# Altium project ASURT_Latch_Egypt.PrjPcb
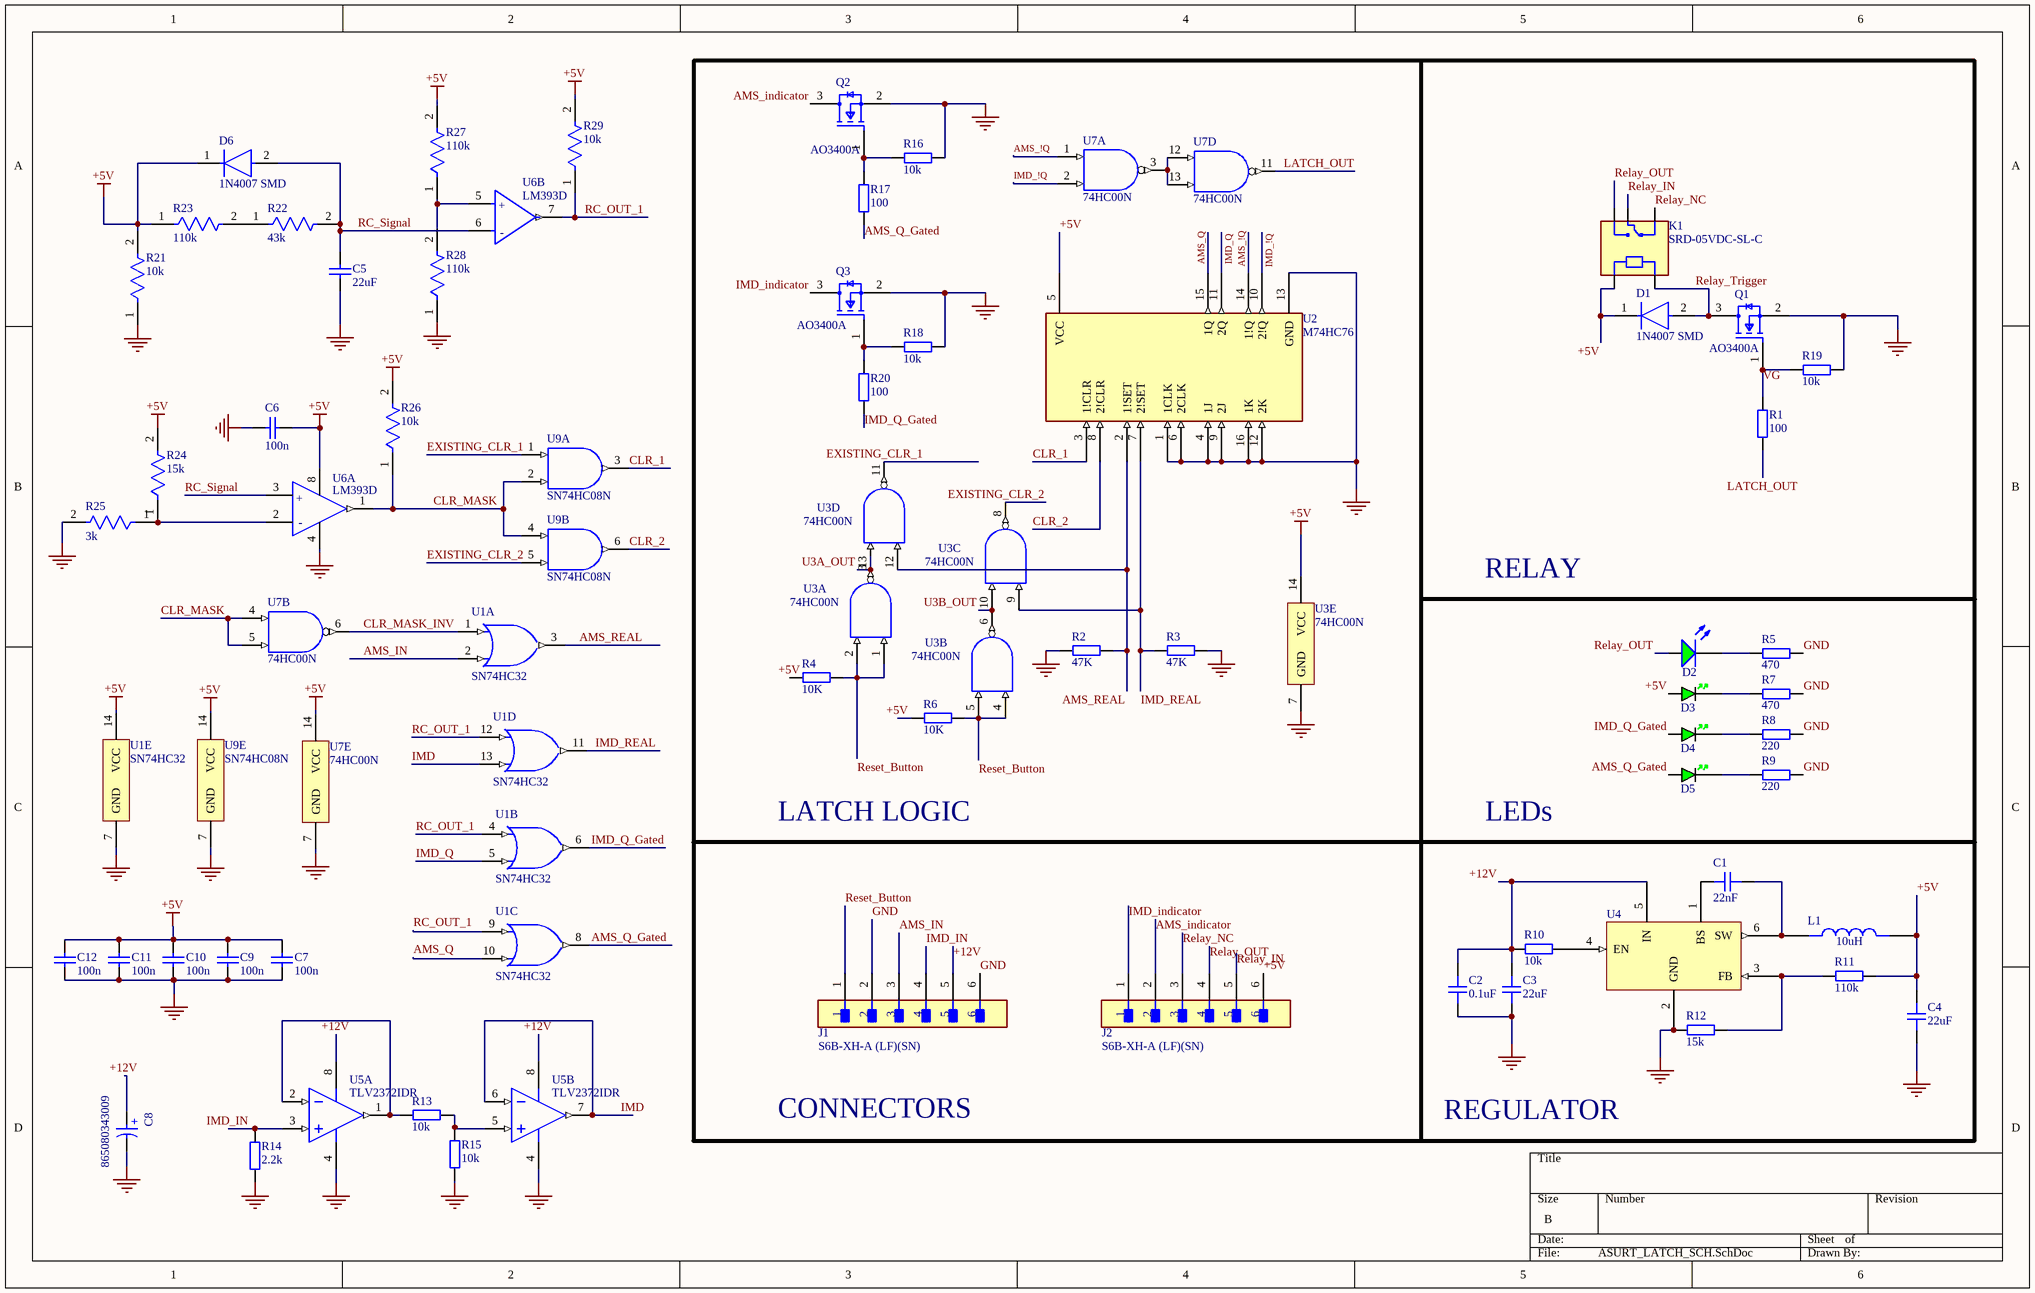
[diagram p0: ASURT_LATCH_SCH.SchDoc]
1 sheet, 62 parts. Net scope: global (net labels, ports and power ports of the same name join across sheets).
Board file: ASURT_LATCH_PCB.PcbDoc

## Sheet ASURT_LATCH_SCH.SchDoc
size B; SheetNumber: 1; SheetTotal: 1

### Parts
C1  22nF  [CAP_0805]
C2  0.1uF  [CAP_0805]
C3  22uF  [CAP_1210]
C4  22uF  [CAP_1210]
C5  22uF  [CAPC2013X145X48ML20T23]
C6  100n  [CAPC2013X145X48ML20T23]
C7  100n  [CAPC2013X145X48ML20T23]
C8  865080343009  [WCAP-ASLI_D6.3H5.5]
C9  100n  [CAPC2013X145X48ML20T23]
C10  100n  [CAPC2013X145X48ML20T23]
C11  100n  [CAPC2013X145X48ML20T23]
C12  100n  [CAPC2013X145X48ML20T23]
D1  1N4007 SMD  [FP-1N4007_SMD-IPC_C]
D2  HLMP-4740  [AVAG-HLMP-4740]  (value not drawn)
D3  GREEN  [LED_0805_GREEN]  (value not drawn)
D4  GREEN  [LED_0805_GREEN]  (value not drawn)
D5  GREEN  [LED_0805_GREEN]  (value not drawn)
D6  1N4007 SMD  [FP-1N4007_SMD-IPC_C]
J1  S6B-XH-A (LF)(SN)  [FP-S6B-XH-A_LF_SN-MFG]
J2  S6B-XH-A (LF)(SN)  [FP-S6B-XH-A_LF_SN-MFG]
K1  SRD-05VDC-SL-C  [RELAY_SRD-05VDC-SL-C]
L1  10uH  [PCBComponent_1 - duplicate1]
Q1  AO3400A  [FP-SOT23-MFG]
Q2  AO3400A  [FP-SOT23-MFG]
Q3  AO3400A  [FP-SOT23-MFG]
R1  100  [RES_0805]
R2  47K  [RES_0805]
R3  47K  [RES_0805]
R4  10K  [RES_0805]
R5  470  [RES_0805]
R6  10K  [RES_0805]
R7  470  [RES_0805]
R8  220  [RES_0805]
R9  220  [RES_0805]
R10  10k  [RES_0805]
R11  110k  [RES_0805]
R12  15k  [RES_0805]
R13  10k  [RES_0805]
R14  2.2k  [RES_0805]
R15  10k  [RES_0805]
R16  10k  [RES_0805]
R17  100  [RES_0805]
R18  10k  [RES_0805]
R19  10k  [RES_0805]
R20  100  [RES_0805]
R21  10k  [FP-RMCF0805-MFG]
R22  43k  [FP-RMCF0805-MFG]
R23  110k  [FP-RMCF0805-MFG]
R24  15k  [FP-RMCF0805-MFG]
R25  3k  [FP-RMCF0805-MFG]
R26  10k  [FP-RMCF0805-MFG]
R27  110k  [FP-RMCF0805-MFG]
R28  110k  [FP-RMCF0805-MFG]
R29  10k  [FP-RMCF0805-MFG]
U1  SN74HC32  [N0014A]  (parts A,B,C,D,E of 5)
U2  M74HC76  [PCBComponent_1]
U3  74HC00N  [NXP-SOT27-1-14]  (parts A,B,C,D,E of 5)
U4  (no value)  [PCBComponent_1 - duplicate]
U5  TLV2372IDR  [D0008A_M]  (parts A,B of 2)
U6  LM393D  [FP-SO8-MFG]  (parts A,B of 2)
U7  74HC00N  [N0014A]  (parts A,B,D,E of 5)
U9  SN74HC08N  [N0014A]  (parts A,B,E of 5)

### Nets
+5V: C4.2 C6.1 C7.2 C9.1 C10.2 C11.1 C12.1 D1.1(C) D3.A D6.1(C) J2.6 K1.A1 L1.2 R4.1 R6.1 R11.1 R21.2 R23.1 R24.2 R26.2 R27.2 R29.2 U1.14(VCC) U2.5(VCC) U3.14(VCC) U6.8(Vcc+) U7.14(VCC) U9.14(VCC)
GND: C2.1 C3.1 C4.1 C5.1 C6.2 C7.1 C8.2(N) C9.2 C10.1 C11.2 C12.2 J1.2 J1.6 Q1.2(S) Q2.2(S) Q3.2(S) R2.1 R3.2 R5.1 R7.1 R8.1 R9.1 R12.2 R14.1 R15.1 R16.1 R18.1 R19.1 R21.1 R25.2 R28.1 U1.7(GND) U2.1(1CLK) U2.4(1J) U2.6(2CLK) U2.9(2J) U2.12(2K) U2.13(GND) U2.16(1K) U3.7(GND) U4.2(GND) U5.4(GND) U6.4(Vcc-) U7.7(GND) U9.7(GND)
+12V: C2.2 C3.2 C8.1(P) J1.5 R10.2 U4.5(IN) U5.8(VDD)
AMS_!Q: U2.14(1!Q) U7.1(1A)
AMS_IN: J1.3 U1.2(1B)
AMS_indicator: J2.2 Q2.3(D)
AMS_Q: U1.10(3B) U2.15(1Q)
AMS_Q_Gated: D5.A R17.1 U1.8(3Y)
AMS_REAL: R2.2 U1.3(1Y) U2.2(1!SET) U3.12(4A)
CLR_1: U2.3(1!CLR) U9.3(1Y)
CLR_2: U2.8(2!CLR) U9.6(2Y)
CLR_MASK: R26.1 U6.1(Out1) U7.4(2A) U7.5(2B) U9.2(1B) U9.4(2A)
CLR_MASK_INV: U1.1(1A) U7.6(2Y)
EXISTING_CLR_1: U3.11(~{4Y}) U9.1(1A)
EXISTING_CLR_2: U3.8(~{3Y}) U9.5(2B)
IMD: U1.13(4B) U5.6(IN2-) U5.7(OUT2)
IMD_!Q: U2.10(2!Q) U7.2(1B)
IMD_IN: J1.4 R14.2 U5.3(IN1+)
IMD_indicator: J2.1 Q3.3(D)
IMD_Q: U1.5(2B) U2.11(2Q)
IMD_Q_Gated: D4.A R20.1 U1.6(2Y)
IMD_REAL: R3.1 U1.11(4Y) U2.7(2!SET) U3.9(3A)
LATCH_OUT: R1.1 U7.11(4Y)
RC_OUT_1: R29.1 U1.4(2A) U1.9(3A) U1.12(4A) U6.7(Out2)
RC_Signal: C5.2 D6.2(A) R22.2 U6.3(In1+) U6.6(In2-)
Relay_IN: J2.5 K1.COM
Relay_NC: J2.3 K1.NC
Relay_OUT: D2.1(A) J2.4 K1.NO
Relay_Trigger: D1.2(A) K1.A2 Q1.3(D)
Reset_Button: J1.1 R4.2 R6.2 U3.1(1A) U3.2(1B) U3.4(2A) U3.5(2B)
U3A_OUT: U3.3(~{1Y}) U3.13(4B)
U3B_OUT: U3.6(~{2Y}) U3.10(3B)
VG: Q1.1(G) R1.2 R19.2
NetC1_1: C1.1 L1.1 U4.6(SW)
NetC1_2: C1.2 U4.1(BS)
NetD2_2: D2.2(K) R5.2
NetD3_K: D3.K R7.2
NetD4_K: D4.K R8.2
NetD5_K: D5.K R9.2
NetQ2_1: Q2.1(G) R16.2 R17.2
NetQ3_1: Q3.1(G) R18.2 R20.2
NetR10_1: R10.1 U4.4(EN)
NetR11_2: R11.2 R12.1 U4.3(FB)
NetR13_1: R13.1 R15.2 U5.5(IN2+)
NetR13_2: R13.2 U5.1(OUT1) U5.2(IN1-)
NetR22_1: R22.1 R23.2
NetR24_1: R24.1 R25.1 U6.2(In1-)
NetR27_1: R27.1 R28.2 U6.5(In2+)
NetU7_3: U7.3(1Y) U7.12(4A) U7.13(4B)

### Notes on the sheet
- RELAY
- LATCH LOGIC
- LEDs
- CONNECTORS
- REGULATOR
- (in symbol CMP-03913-53914574-2) +
- (in symbol CMP-12132-000003-1, part A) +; -
- (in symbol CMP-12132-000003-1, part B) +; -

### Library data of the parts
C1 C2 = CAP_0805: Capacitor SMD 0805; Manufacturer: *; Manufacturer Part Number: *; Distributor Link: *; LCSC: *; Rating: *; Dielectric: *
C3 C4 = CAP_1210: Capacitor SMD 1210; Manufacturer: *; Manufacturer Part Number: *; Distributor Link: *; LCSC: *; Rating: *; Dielectric: *
C5-C7 C9-C12 = CMP-2007-03205-1: Manufacturer: Vitramon; Part Number: VJ0805Y682KXAMT
C8 = CMP-03913-53914574-2: Alum. Electrolytic Cap 100UF 16V 6.3MMV-CHIP Wcap-asli, Lifetime 2000H +105OC; Ripple Current: 255mA; Life (Hours): 2000hours; Leakage Current: 16µA; Tolerance: 20%; Impedance: 520mΩ; Capacitance: 100µF; ESR (Equivalent Series Resistance): 399.422mΩ; Insulation Resistance: 1MΩ; Polarity: Polar; Diameter: 6.3mm; Width: 6.6mm; REACH SVHC: Unknown; Lead Free: Lead Free; Ripple Current (AC): 255mA; Voltage Rating: 16V; Max Operating Temperature: 105°C; Case/Package: Radial; Height: 5.5mm; Mount: Surface Mount; Voltage Rating (DC): 16V; RoHS: Compliant; Min Operating Temperature: -55°C; Height - Seated (Max): 5.5118mm; Length: 5.5mm
D1 D6 = CMP-12389-000001-1: Rectifier, 1Kv, 1A, Do-214Ac Rohs Compliant: Yes
D2 = CMP-2000-06413-1: T-1 3/4 (5 mm) Low Current LED Lamp, Green, 1.9 V, -20 to 100 degC, 2-Pin THD, RoHS, Bulk; Manufacturer: AvagoTechnologies; Type: Uni-Color; Peak Wavelength: 565nm; Rad Hard: No; Viewing Angle: 50°; Dominant Wavelength/Color Temperature: 569nm; Number of LEDs: 1; Lens Appearance: ColoredDiffused; Lens Shape Type: Circular; Mounting Orientation: TopMount; Intensity: 2.3mcd; Datasheet Version: 07/2014; Category: LEDs; Datasheet URL: http://docs.avagotech.com/docs/AV02-1557EN; Packaging: Bulk; Pin Count: 2; Mounting Technology: ThroughHole; Package Reference: HLMP-4740; Mounting: ThroughHole; Manufacturer URL: http://www.avagotech.com/; Color: Green; Package: 2T-13/4; Package Description: 2-Pin Through Hole Device, Dia 5.845 mm, Pitch 2.54 mm
D3-D5 = LED_0805_GREEN: LED 0805 GREEN SMD; Manufacturer: *; Manufacturer Part Number: *; Distributor Link: *; LCSC: *
J1 J2 = CMP-17439-000165-2: CONN HEADER R/A 6POS 2.5MM; Number of Contacts: 6; Contact Resistance: 20mR; Max Current Rating: 3A; Max Voltage Rating (AC): 250V; Gender: Male; Insulation Resistance: 1GR; Wire/Cable Gauge: 22AWG; Fastening Type: Detent; Lead Pitch: 2.5mm; Flammability Rating: UL94 V-0; Contact Finish - Mating: TIN; Housing Material: Polyamide; Length: 17.4mm; Termination: Solder; Contact Type: Male Pin; Number of Positions: 6; Mount: Through Hole; Orientation: Right Angle; Voltage Rating (AC): 250V; Contact Shape: Square; Lead Free: Lead Free; Insulation Material: Nylon; Insulation Color: Natural; Contact Plating: Tin; Connector Type: Header; Housing Color: White; Color: Natural; Package Quantity: 500; Contact Material: Brass; Packaging: Bulk; Pitch: 2.5mm; Series: XH; Number of Rows: 1; Min Operating Temperature: -25°C; Voltage Rating: 250V; REACH SVHC: No SVHC; Current Rating: 3A; Depth: 11.5mm; Max Operating Temperature: 85°C
K1 = SRD-05VDC-SL-C: 5V Trigger Relay Module For Arduino And Raspberry Pi 5V Trigger Relay Module For Arduino And Raspberry Pi; MF: Songle Relay; Check_prices: https://www.snapeda.com/parts/SRD-05VDC-SL-C/Songle+Relay/view-part/?ref=eda; Value: *; Availability: Not in stock; Price: None; Package: NON STANDARD-5 Songle Relay; MP: SRD-05VDC-SL-C; SnapEDA_Link: https://www.snapeda.com/parts/SRD-05VDC-SL-C/Songle+Relay/view-part/?ref=snap
L1 = 10uH INDUCTOR
Q1-Q3 = CMP-83955-000006-1: MOSFET N-CH 30V 5.7A SOT23; Input Capacitance: 630pF; Number of Elements: 1; Rds On Max: 26.5mR; Max Power Dissipation: 1.4W; Gate to Source Voltage (Vgs): 12V; Min Operating Temperature: -55°C; Lead Free: Lead Free; Number of Pins: 3; Drain to Source Voltage (Vdss): 30V; Case/Package: SOT-23; Mount: Surface Mount; Continuous Drain Current (ID): 5.7A; Radiation Hardening: No; Packaging: Tape and Reel; Max Operating Temperature: 150°C; Power Dissipation: 1.4W
R1-R20 = RES_0805: Resistor SMD 0805; Manufacturer: *; Manufacturer Part Number: *; Distributor Link: *; LCSC: *
R21-R29 = CMP-26527-003091-1: 33kΩ ±5% 0.125W 0805 Thick Film Chip Resistor AEC-Q200 compliant; Resistance: 33kR; Max Power Dissipation: 125mW; Temperature Coefficient: 200ppm/°C; Packaging: Tape and Reel; Resistor Type: Thick Film; Number of Terminations: 2; Series: RMCF; Radiation Hardening: No; Tolerance: 5%; Height: 0.026inch; Mount: Surface Mount; Package Quantity: 10000; Features: Automotive AEC-Q200; Width: 0.049inch; Max Operating Temperature: 155°C; Contact Plating: Tin; Length: 0.079inch; Case/Package: 0805; RoHS Compliant: Yes; Min Operating Temperature: -55°C
U1 = CMP-1573-00140-3: Quad 2-input positive-OR gates, N0014A, TUBE; Manufacturer: Texas Instruments; Generic Part Number: SN7432; VCC(Max)(V): 5.25; Voltage(Nom)(V): 5; VCC(Min)(V): 4.75; F @ Nom Voltage(Max)(Mhz): 100; Output Type: TTL; Output Drive (IOL/IOH)(Max)(mA): 0.8/-16; ICC @ Nom Voltage(Max)(mA): 0.038; Bits(#): 4; tpd @ Nom Voltage(Max)(ns): 22; Rating: Catalog; PackageVersion: http://www.ti.com/lit/ml/mpdi002c/mpdi002c.pdf; Operating Temperature Range(C): 0 to 70; DatasheetVersion: SDLS100; Code_JEDEC: MS-001; Input Type: TTL; PackageReference: N0014A
U2 = M74HC76: dual J-K flip-flop with preset and clear
U3 = CMP-0976-00001-1: Quad 2-input NAND gate, CMOS, 2 to 6 V, -40 to 125 degC, 14-Pin DIP (SOT27-1), RoHS, Bulk; Manufacturer: NXP Semiconductors; VCC (V): 2 to 6; Nr of bits: 4; tpd (ns): 7; Output drive capability (mA): +/- 5.2; fmax (MHz): 36; PackageReference: SOT27-1; ComponentLink1URL: http://www.nxp.com/; ComponentLink3Description: Package Specification; ComponentLink1Description: Manufacturer URL; DatasheetVersion: Rev. 6; Temperature Range: -40 to 125 degC; ComponentLink2Description: Datasheet; RoHS: TRUE; ComponentLink2URL: http://www.nxp.com/documents/data_sheet/74HC_HCT00.pdf; PackageVersion: Feb-03; PartNumber: 74HC00N; Input levels: CMOS; PackageDescription: 14-Pin plastic dual in-line package, Body 19.025 x 6.34 mm, Pitch 2.54 mm; Mounting Technology: Through Hole; ComponentLink3URL: http://www.nxp.com/documents/outline_drawing/sot027-1_po.pdf; Packing: Bulk
U4 = MT2492: DC-DC step-down converter (buck converter)
U5 = CMP-0272-02948-3: 550 uA/Ch, 3 MHz, RRIO Operational Amplifier, 2.7 to 16 V, -40 to 125 degC, 8-pin SOIC (D8), Green (RoHS & no Sb/Br); Manufacturer: Texas Instruments; GBW(Typ)(MHz): 3; Offset Drift(Typ)(uV/C): 2; Total Supply Voltage(Max)(+5V is 5, +/-5V is 10): 16; Vio (25C)(Max)(mV): 4.5; Iq per channel(Max)(mA): 0.9; Packing: LARGE T&R; Sub Family: Low Supply Voltage Amplifier (<=2.7V), Precision Amplifier; IIB(Max)(pA): 60; Rating: Catalog; CMRR(Min)(dB): 50; Total Supply Voltage(Min)(+5V is 5, +/-5V is 10): 2.7; Slew Rate(Typ)(V/us): 2.4; ComponentLink1URL: http://www.ti.com/; ComponentLink2Description: Datasheet; PartNumber: TLV2372IDR; Code_JEDEC: MS-012; PackageDescription: 8-Pin Plastic Small Outline, Body 4.9 x 3.9 mm, Pitch 1.27 mm; ComponentLink1Description: Manufacturer URL; DatasheetVersion: SLOS270D; ComponentLink3Description: Package Specification; ComponentLink2URL: http://www.ti.com/lit/ds/symlink/tlv2372.pdf; ComponentLink3URL: http://www.ti.com/litv/pdf/msoi002j; Mounting Technology: Surface Mount; PackageVersion: 4040047-3/M, 06/2011; Eco-Plan: Green (RoHS & no Sb/Br); Number of Channels: 2; PackageReference: D0008A
U6 = CMP-12132-000003-1: IC VOLT COMPARATOR DUAL LP 8SOIC; Manufacturer: STMicroelectronics; Response Time: 1.3us; Min Supply Voltage: 2V; Input Offset Voltage: 1mV; Input Bias Current: 0.02uA; Max Dual Supply Voltage: 18V; Output Current Per Channel: 18mA; Max Junction Temp: +150°C; Standoff Height: 0.1mm; Number Of Channels: 2; Nominal Supply Current: 0.45-0.6mA; Voltage Gain: 200V/mV; Max Supply Voltage: 36V; Min Dual Supply Voltage: 1V; Ambient Temperature Range Low: 0°C; ComponentLink2Description: Datasheet; Lead Free: Yes; Device Class L3: Comparators; Device Class L2: Linear ICs; Manufacturer Part Number: LM393D; Digikey Description: IC VOLT COMPARATOR DUAL LP 8SOIC; Category: IC; Octopart: https://octopart.com/lm393d-stmicroelectronics-25832; Package: SO8; RoHS: TRUE; Footprint Url: https://www.st.com/resource/en/datasheet/stm8l001j3.pdf; Temperature Range Low: 0°C; Temperature Range High: +70°C; Mouser Description: Analog Comparators Lo-Pwr Dual Voltage; ComponentLink2URL: https://www.st.com/resource/en/datasheet/lm393.pdf; Automotive: No; Temperature: 0°C to +70°C; Height: 1.75mm; Device Class L1: Integrated Circuits (ICs); Ambient Temperature Range High: +70°C
U7 = CMP-1627-00501-2: Quad 2-input positive-NAND gates, N0014A, TUBE; Manufacturer: Texas Instruments; Generic Part Number: SN7400; Input Type: TTL; Voltage(Nom)(V): 5; VCC(Max)(V): 5.25; Schmitt Trigger: No; Output Drive (IOL/IOH)(Max)(mA): 0.4/-16; tpd @ Nom Voltage(Max)(ns): 22; F @ Nom Voltage(Max)(Mhz): 75; Bits(#): 4; VCC(Min)(V): 4.75; Rating: Catalog; ICC @ Nom Voltage(Max)(mA): 0.022; PackageReference: N0014A; Code_JEDEC: MS-001; Technology Family: TTL; Operating Temperature Range(C): 0 to 70; Output Type: TTL; DatasheetVersion: SDLS025B
U9 = CMP-0777-00282-3: Quad 2-input positive-AND gates, N0014A, TUBE; Manufacturer: Texas Instruments; Generic Part Number: SN74S08; Output Drive (IOL/IOH)(Max)(mA): -24/24; Rating: Catalog; VCC(Min)(V): 4.75; Bits(#): 4; Input Type: TTL; Schmitt Trigger: No; tpd @ Nom Voltage(Max)(ns): 7.5; Technology Family: S; Voltage(Nom)(V): 5; VCC(Max)(V): 5.25; F @ Nom Voltage(Max)(Mhz): 50; ICC @ Nom Voltage(Max)(mA): 0.032; PackageReference: N0014A; DatasheetVersion: SDLS033; Operating Temperature Range(C): 0 to 70; Output Type: TTL